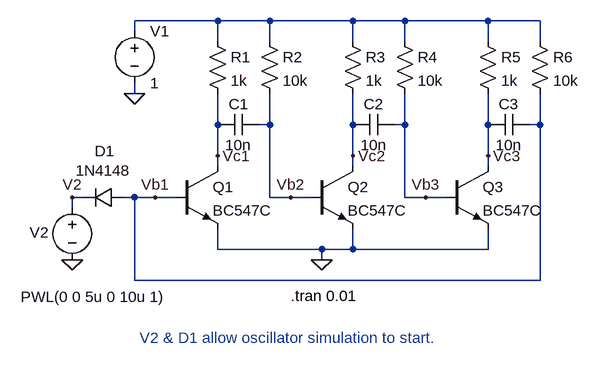
[diagram p0: schematic multivibrator-with-kickstarter.asc]
multivibrator-with-kickstarter.asc, the LTspice schematic file:
Version 4
SHEET 1 880 680
WIRE 160 -96 32 -96
WIRE 240 -96 160 -96
WIRE 368 -96 240 -96
WIRE 448 -96 368 -96
WIRE 576 -96 448 -96
WIRE 656 -96 576 -96
WIRE 32 -80 32 -96
WIRE 160 -64 160 -96
WIRE 240 -64 240 -96
WIRE 368 -64 368 -96
WIRE 448 -64 448 -96
WIRE 576 -64 576 -96
WIRE 656 -64 656 -96
WIRE 32 16 32 0
WIRE 160 64 160 16
WIRE 240 64 240 16
WIRE 240 64 224 64
WIRE 368 64 368 16
WIRE 448 64 448 16
WIRE 448 64 432 64
WIRE 576 64 576 16
WIRE 656 64 656 16
WIRE 656 64 640 64
WIRE 160 112 160 64
WIRE 368 112 368 64
WIRE 576 112 576 64
WIRE 160 128 160 112
WIRE 368 128 368 112
WIRE 576 128 576 112
WIRE -48 176 -64 176
WIRE 32 176 16 176
WIRE 64 176 32 176
WIRE 96 176 64 176
WIRE 240 176 240 64
WIRE 272 176 240 176
WIRE 304 176 272 176
WIRE 448 176 448 64
WIRE 480 176 448 176
WIRE 512 176 480 176
WIRE -64 192 -64 176
WIRE 160 256 160 224
WIRE 320 256 160 256
WIRE 368 256 368 224
WIRE 368 256 320 256
WIRE 576 256 576 224
WIRE 576 256 368 256
WIRE 320 272 320 256
WIRE 32 304 32 176
WIRE 656 304 656 64
WIRE 656 304 32 304
FLAG 320 272 0
FLAG 32 16 0
FLAG 160 112 Vc1
FLAG 368 112 Vc2
FLAG 272 176 Vb2
FLAG 576 112 Vc3
FLAG 480 176 Vb3
FLAG 64 176 Vb1
FLAG -64 272 0
FLAG -64 176 V2
SYMBOL npn 96 128 R0
SYMATTR InstName Q1
SYMATTR Value BC547C
SYMBOL npn 304 128 R0
SYMATTR InstName Q2
SYMATTR Value BC547C
SYMBOL cap 224 48 R90
WINDOW 0 0 32 VBottom 2
WINDOW 3 32 32 VTop 2
SYMATTR InstName C1
SYMATTR Value 10n
SYMBOL cap 432 48 R90
WINDOW 0 0 32 VBottom 2
WINDOW 3 32 32 VTop 2
SYMATTR InstName C2
SYMATTR Value 10n
SYMBOL res 144 -80 R0
SYMATTR InstName R1
SYMATTR Value 1k
SYMBOL res 224 -80 R0
SYMATTR InstName R2
SYMATTR Value 10k
SYMBOL res 352 -80 R0
SYMATTR InstName R3
SYMATTR Value 1k
SYMBOL res 432 -80 R0
SYMATTR InstName R4
SYMATTR Value 10k
SYMBOL voltage 32 -96 R0
WINDOW 123 0 0 Left 0
WINDOW 39 24 44 Left 2
SYMATTR InstName V1
SYMATTR Value 1
SYMBOL npn 512 128 R0
SYMATTR InstName Q3
SYMATTR Value BC547C
SYMBOL cap 640 48 R90
WINDOW 0 0 32 VBottom 2
WINDOW 3 32 32 VTop 2
SYMATTR InstName C3
SYMATTR Value 10n
SYMBOL res 560 -80 R0
SYMATTR InstName R5
SYMATTR Value 1k
SYMBOL res 640 -80 R0
SYMATTR InstName R6
SYMATTR Value 10k
SYMBOL diode 16 160 R90
WINDOW 0 -40 30 VBottom 2
WINDOW 3 -41 32 VTop 2
SYMATTR InstName D1
SYMATTR Value 1N4148
SYMBOL voltage -64 176 R0
WINDOW 0 -65 54 Left 2
WINDOW 3 -79 153 Left 2
WINDOW 123 0 0 Left 0
WINDOW 39 0 0 Left 0
SYMATTR InstName V2
SYMATTR Value PWL(0 0 5u 0 10u 1)
TEXT 272 328 Left 2 !.tran 0.01
TEXT 40 392 Left 2 ;V2 & D1 allow oscillator simulation to start.

The netlist it stands for:
* multivibrator-with-kickstarter.asc
Q1 Vc1 Vb1 0 0 BC547C
Q2 Vc2 Vb2 0 0 BC547C
C1 Vb2 Vc1 10n
C2 Vb3 Vc2 10n
R1 N001 Vc1 1k
R2 N001 Vb2 10k
R3 N001 Vc2 1k
R4 N001 Vb3 10k
V1 N001 0 1
Q3 Vc3 Vb3 0 0 BC547C
C3 Vb1 Vc3 10n
R5 N001 Vc3 1k
R6 N001 Vb1 10k
D1 Vb1 V2 1N4148
V2 V2 0 PWL(0 0 5u 0 10u 1)
.model D D
.lib standard.dio
.model NPN NPN
.model PNP PNP
.lib standard.bjt
.tran 0.01
* V2 & D1 allow oscillator simulation to start.
.backanno
.end